# Altium schematic sheet Safety Thermocouple Interface - MCU.SchDoc: Thermocouple Interface - MCU
size A4; Organization: PEI; Address1: 22 Russell Crescent; Address2: Western Heights; Address3: Rotorua; Address4: New Zealand 3015; DocumentNumber: N/A; Revision: 0; SheetNumber: 1; SheetTotal: 2
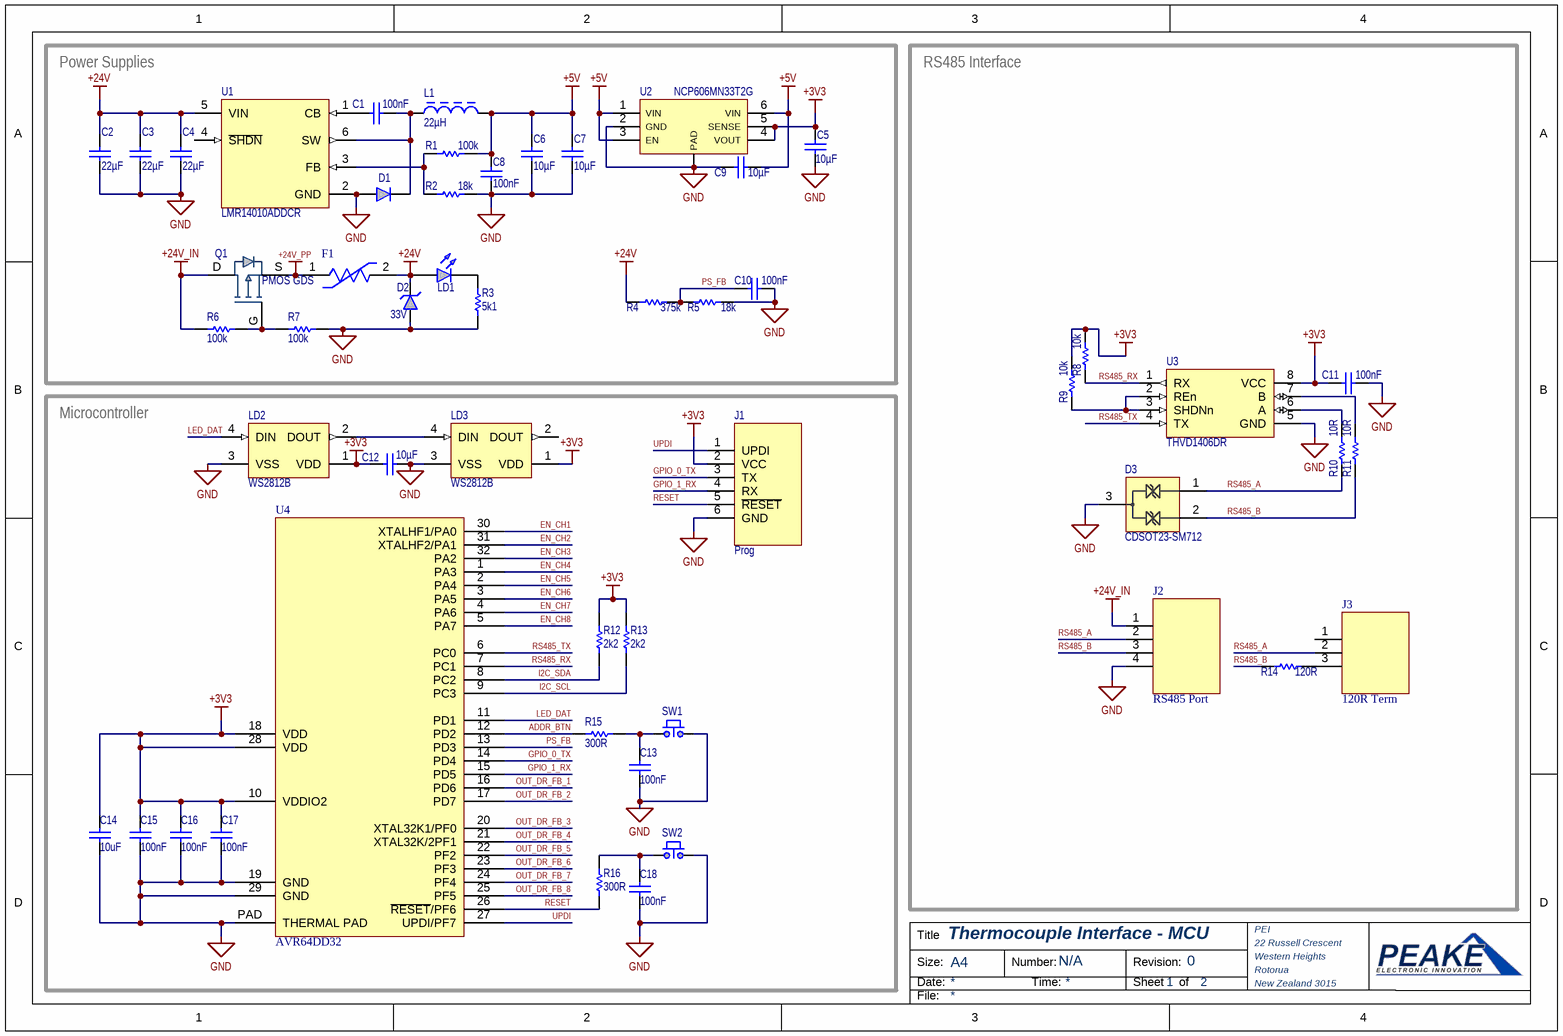
[diagram p0: Safety Thermocouple Interface - MCU.SchDoc]

## Parts
C1  value 100nF  [0603_CAP]  (hidden comment: Capacitor)
C2  value 22µF  [1206_CAP]  (hidden comment: Capacitor)
C3  value 22µF  [1206_CAP]  (hidden comment: Capacitor)
C4  value 22µF  [1206_CAP]  (hidden comment: Capacitor)
C5  value 10µF  [0603_CAP]  (hidden comment: Capacitor)
C6  value 10µF  [0603_CAP]  (hidden comment: Capacitor)
C7  value 10µF  [0603_CAP]  (hidden comment: Capacitor)
C8  value 100nF  [0603_CAP]  (hidden comment: Capacitor)
C9  value 10µF  [0603_CAP]  (hidden comment: Capacitor)
C10  value 100nF  [0603_CAP]  (hidden comment: Capacitor)
C11  value 100nF  [0603_CAP]  (hidden comment: Capacitor)
C12  value 10µF  [0603_CAP]  (hidden comment: Capacitor)
C13  value 100nF  [0603_CAP]  (hidden comment: Capacitor)
C14  value 10uF  [0603_CAP]  (hidden comment: Capacitor)
C15  value 100nF  [0603_CAP]  (hidden comment: Capacitor)
C16  value 100nF  [0603_CAP]  (hidden comment: Capacitor)
C17  value 100nF  [0603_CAP]  (hidden comment: Capacitor)
C18  value 100nF  [0603_CAP]  (hidden comment: Capacitor)
D1  Diode  [SOD-123]  (value not drawn)
D2  Rated Voltage: 33V  [SMBJ]  (hidden comment: Transil)
D3  CDSOT23-SM712  [FP-SOT23-IPC_C]
F1  0ZCF0100AF2A  [FP-0ZCF0100AF2A-MFG]  (value not drawn)
J1  Prog  [DIP6]
J2  RS485 Port  [4_Pin  DB2EVC-3.81-4P-GN LCSC version]
J3  120R Term  [SIP3]
L1  value 22µH  [BOUR-SRN8040_V]  (hidden comment: Inductor)
LD1  LED  [0805]  (value not drawn)
LD2  WS2812B  [WS2812B-2020]
LD3  WS2812B  [WS2812B-2020]
Q1  PMOS GDS  [PowerDI 5060-8]
R1  value 100k  [0603_RES]  (hidden comment: Resistor)
R2  value 18k  [0603_RES]  (hidden comment: Resistor)
R3  value 5k1  [0603_RES]  (hidden comment: Resistor)
R4  value 375k  [0603_RES]  (hidden comment: Resistor)
R5  value 18k  [0603_RES]  (hidden comment: Resistor)
R6  value 100k  [0603_RES]  (hidden comment: Resistor)
R7  value 100k  [0603_RES]  (hidden comment: Resistor)
R8  value 10k  [0603_RES]  (hidden comment: Resistor)
R9  value 10k  [0603_RES]  (hidden comment: Resistor)
R10  value 10R  [0603_RES]  (hidden comment: Resistor)
R11  value 10R  [0603_RES]  (hidden comment: Resistor)
R12  value 2k2  [0603_RES]  (hidden comment: Resistor)
R13  value 2k2  [0603_RES]  (hidden comment: Resistor)
R14  value 120R  [0603_RES]  (hidden comment: Resistor)
R15  value 300R  [0603_RES]  (hidden comment: Resistor)
R16  value 300R  [0603_RES]  (hidden comment: Resistor)
SW1  EVP-AAN02Q  [FP-EVP-AAN02Q-MFG]  (value not drawn)
SW2  EVP-AAN02Q  [FP-EVP-AAN02Q-MFG]  (value not drawn)
U1  LMR14010ADDCR  [FP-DDC0006A-IPC_A]
U2  NCP606MN33T2G  [QFN95P330X295X100_HS-7N]
U3  THVD1406DR  [SOIC127P600X175-8N]
U4  AVR64DD32  [32P VQFN]

## Blocks framed on the sheet
Power Supplies: C1-C10 D1 D2 F1 L1 LD1 Q1 R1-R7 U1 U2
RS485 Interface: C11 D3 J2 J3 R8-R11 R14 U3
Microcontroller: C12-C18 J1 LD2 LD3 R12 R13 R15 R16 SW1 SW2 U4

## Nets
+3V3: C5.1 C11.2 C12.2 C14.2 C15.2 C16.2 C17.2 J1.2(VCC) LD2.1(VDD) LD3.1(VDD) R8.1 R9.1 R12.1 R13.1 U2.4(VOUT) U2.5(SENSE) U3.8(VCC) U4.10(VDDIO2) U4.18(VDD) U4.28(VDD)
+5V: C6.1 C7.1 C8.1 C9.1 L1.2 R1.2 U2.1(VIN) U2.3(EN) U2.6(VIN)
+24V: C2.1 C3.1 C4.1 D2.2(K) F1.2 LD1.2(A) R4.1 U1.5(VIN)
+24V_IN: J2.1 Q1.D R6.1
+24V_PP: F1.1 Q1.S
GND: C2.2 C3.2 C4.2 C5.2 C6.2 C7.2 C8.2 C9.2 C10.2 C11.1 C12.1 C13.1 C14.1 C15.1 C16.1 C17.1 C18.1 D1.2(A) D2.1(A) D3.3 J1.6(GND) J2.4 LD2.3(VSS) LD3.3(VSS) R2.2 R3.2 R5.1 R7.2 SW1.2 SW2.2 U1.2(GND) U2.2(GND) U2.PAD U3.5(GND) U4.19(GND) U4.29(GND) U4.PAD(THERMAL_PAD)
ADDR_BTN: R15.2 U4.12(PD2)
EN_CH1: U4.30(XTALHF1/PA0)
EN_CH2: U4.31(XTALHF2/PA1)
EN_CH3: U4.32(PA2)
EN_CH4: U4.1(PA3)
EN_CH5: U4.2(PA4)
EN_CH6: U4.3(PA5)
EN_CH7: U4.4(PA6)
EN_CH8: U4.5(PA7)
GPIO_0_TX: J1.3(TX) U4.14(PD4)
GPIO_1_RX: J1.4(RX) U4.15(PD5)
I2C_SCL: R13.2 U4.9(PC3)
I2C_SDA: R12.2 U4.8(PC2)
LED_DAT: LD2.4(DIN) U4.11(PD1)
OUT_DR_FB_1: U4.16(PD6)
OUT_DR_FB_2: U4.17(PD7)
OUT_DR_FB_3: U4.20(XTAL32K1/PF0)
OUT_DR_FB_4: U4.21(XTAL32K/2PF1)
OUT_DR_FB_5: U4.22(PF2)
OUT_DR_FB_6: U4.23(PF3)
OUT_DR_FB_7: U4.24(PF4)
OUT_DR_FB_8: U4.25(PF5)
PS_FB: C10.1 R4.2 R5.2 U4.13(PD3)
RESET: J1.5(~{RESET}) R16.1 U4.26(~{RESET}/PF6)
RS485_A: D3.1 J2.2 J3.2 R10.1
RS485_B: D3.2 J2.3 R11.1 R14.1
RS485_RX: R8.2 U3.1(RX) U4.7(PC1)
RS485_TX: U3.4(TX) U4.6(PC0)
UPDI: J1.1(UPDI) U4.27(UPDI/PF7)
NetC1_1: C1.1 D1.1(K) L1.1 U1.6(SW)
NetC1_2: C1.2 U1.1(CB)
NetC13_2: C13.2 R15.1 SW1.1
NetC18_2: C18.2 R16.2 SW2.1
NetJ3_3: J3.3 R14.2
NetLD1_1: LD1.1(K) R3.1
NetLD2_2: LD2.2(DOUT) LD3.4(DIN)
NetQ1_G: Q1.G R6.2 R7.1
NetR1_1: R1.1 R2.1 U1.3(FB)
NetR9_2: R9.2 U3.2(REn) U3.3(SHDNn)
NetR10_2: R10.2 U3.6(A)
NetR11_2: R11.2 U3.7(B)

Not connected (* = marked no-connect by the designer): J3 1; LD3 2(DOUT); U1 4(~{SHDN})

## Notes on the sheet
- Title
- Size:
- Date:
- A4
- Number:
- Time:
- Revision:
- Sheet
- of
- File:

## Library data of the parts
C1-C12 = CMP-001-00172-2: SMD Capacitor; Pins: 2; Source: Discrete.SchLib; Design Item ID: Capacitor; Component Type: Standard
C13-C18 = CMP-001-00172-1: SMD Capacitor; Pins: 2; Source: Discrete.SchLib; Component Type: Standard; Design Item ID: Capacitor
D1 = CMP-004-00083-4: SMD Diode; Design Item ID: Diode; Pins: 2; Source: Discrete.SchLib; Component Type: Standard; Pin Count: 2
D2 = CMP-079-000108-2: Transient Voltage Suppressor; MFN: SMBJ33A; Component Type: Standard; Pin Count: 2; Source: Discrete.SchLib; Breakdown Voltage: *; Design Item ID: Transil; Clamping Voltage: *
D3 = CDSOT23-SM712-3: Trans Voltage Suppressor Diode, 400W, 7V V(RWM), Bidirectional, 2 Element, Silicon; Number of Elements: 2; Min Breakdown Voltage: 7.5V; Qualification Status: Not Qualified; Clamping Voltage-Max: 19V; Reference Standard: IEC-61000-4-2; Package Body Material: Plastic; Technology: AVALANCHE; JESD-30 Code: R-PDSO-G3; Moisture Sensitivity Level: 1; Polarity: Bidirectional; Diode Element Material: SILICON; Rep Pk Reverse Voltage-Max: 7V; JESD-609 Code: e3; Non-rep Peak Rev Power Dis-Max: 400W; Diode Type: TRANS VOLTAGE SUPPRESSOR; Package Style: SMALL OUTLINEMeter; Pins: 3; Surface Mount: Yes; Breakdown Voltage-Nom: 7.5V; Reach SVHC Compliant: Yes; Package Shape: Rectangular; Terminal Form: Gull Wing; RoHS Compliant: Yes; Terminal Position: DUAL; Terminal Finish: Tin
F1 = CMP-005-00014-2: PTC Resettable Fuse 100A 0.5s 60VDC 0.09 Ohm 2-Pin 2920 T/R; Time to Trip: 500ms; Hold Current: 1A; Trip Current: 2A; Pins: 2; Component Type: Standard; Thickness: 0.067inch; Width: 0.202inch; Series: 0ZCF; Max Operating Temperature: 85°C; Source: All Components - 30.06.23 - 18.27.SchLib; Min Operating Temperature: -40°C; Design Item ID: CMP-00051-1; Length: 0.29inch; Case/Package: 2920; RoHS Compliant: Yes; Packaging: Cut Tape; Max Current Rating: 100A; Case Code (Metric): 7351; Mount: Surface Mount
J1 = CMP-002-00180-1: 6 Pin Connector; Component Type: Standard; Design Item ID: 6_Pin; Pins: 6; Source: Connectors.SchLib; Pin Count: 6
J2 = CMP-002-00177-3: 4 Pin Connector; Pins: 4; Design Item ID: 4_Pin; Component Type: Standard; Pin Count: 4; Source: Connectors.SchLib
J3 = CMP-002-00174-3: 3 Pin Connector; Pin Count: 3; Source: Connectors.SchLib; Pins: 3; Component Type: Standard; Design Item ID: 3_Pin
L1 = CMP-006-00052-2: Power Inductor; DCR: 100mR; Current Rating: 2.2A; Pins: 2; Component Type: Standard; Design Item ID: Inductor; Source: Discrete.SchLib; Pin Count: 2; MFN: *
LD1 = CMP-004-00084-3: SMD LED; Colour: RED; Pins: 2; Source: Discrete.SchLib; Design Item ID: LED; Component Type: Standard; Pin Count: 2
LD2 LD3 = CMP-079-000113-2: Intelligent Control LED Integrated Light Source, 3.5 to 5.3 V, -25 to 80 degC, 4-Pin SMD, RoHS, Bulk; Manufacturer: Adafruit Industries; Mounting Technology: SM; RoHS Compliant: False; Package Reference: WS2812B; Case/Package: WS2812B; Component Type: Standard; Manufacturer URL: https://www.adafruit.com/; Package Description: 4-Pin Surface Mount Device, Body 5 x 5 mm, Pitch 3.3 mm; Source: All Components - 30.06.23 - 18.27.SchLib; Datasheet Version: May-13; Datasheet URL: https://cdn-shop.adafruit.com/datasheets/WS2812B.pdf; Pin Count: 4; Design Item ID: CMP-007-00035-3
Q1 = CMP-079-000102-2: P Channel MOSFET; MFN: *; Design Item ID: PMOS GDS; VGS Max: *; Continuous Current: *; VDS Breakdown: *; Source: P-MOS.SchLib; Component Type: Standard; Pin Count: 3
R1-R16 = CMP-009-00356-1: SMD Resistor; Pins: 2; Source: Discrete.SchLib; Component Type: Standard; Design Item ID: Resistor
SW1 SW2 = CMP-011-00000-2: Switch Tactile N.O. SPST Rectangular Button J-Bend 0.02A 15VDC 100000Cycles 5N SMD T/R
U1 = CMP-079-000005-5: 7-40VDC-DC buck converter; Number of Outputs: 1; Max Output Voltage: 40V; Output Current: 1A; Min Input Voltage: 4V; Output Type: Adjustable; Synchronous Rectifier: No; Min Output Voltage: 765mV; Output Configuration: Positive; Switching Frequency: 850kHz; Max Operating Temperature: 125°C; Case/Package: SOT-23-6; Features: UVLO; Pin Count: 6; Packaging: Cut Tape; Mount: Surface Mount; Component Type: Standard; Min Operating Temperature: -40°C; Max Input Voltage: 40V; Source: All Components - 30.06.23 - 18.27.SchLib; Design Item ID: CMP-00007-1
U2 = CMP-019-00001-1: Fixed Positive LDO Regulator, 3.3V, 0.22V Dropout, CMOS; Max Supply Voltage: 6V; RoHS Compliant: Yes; Case/Package: HVSON; Pins: 6
U3 = CMP-015-00008-1: Line Transceiver, 1 Func, 1 Driver, 1 Rcvr, PDSO8; RoHS Compliant: Yes
U4 = CMP-031-00048-2: AVR DD series 24MHz 8-bit 32 pin MCU 1.8-5.5V, multi voltage, 27 GPIO, 64K flash, 8K SRAM, 256b EEPROM.; Source: All Components - 30.06.23 - 18.27.SchLib; Pin Count: 33; Design Item ID: CMP-00041-1; Component Type: Standard